# Altium schematic sheet LaunchpadHeader.SchDoc
size A4; SheetNumber: 2; SheetTotal: 4
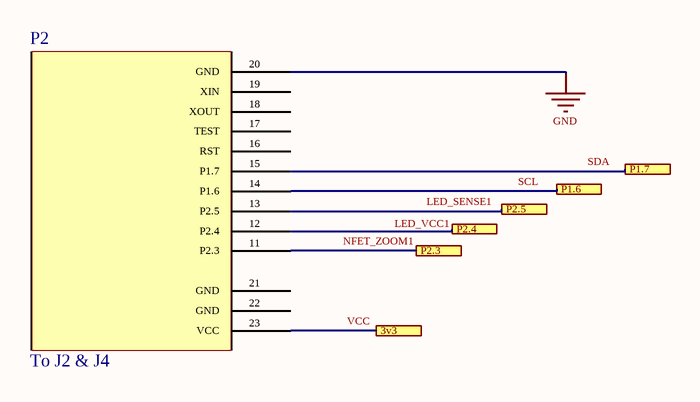
[diagram p0: LaunchpadHeader.SchDoc]

## Parts
P2  To J2 & J4  [MSP-EXP430G2 Mating Headers for J2/J4]

## Ports
3v3, P1.6, P1.7, P2.3, P2.4, P2.5

## Nets
GND: P2.20(GND)
3v3: P2.23(VCC) ; port 3v3
P1.6: P2.14(P1.6) ; port P1.6
P1.7: P2.15(P1.7) ; port P1.7
P2.3: P2.11(P2.3) ; port P2.3
P2.4: P2.12(P2.4) ; port P2.4
P2.5: P2.13(P2.5) ; port P2.5

Not connected (* = marked no-connect by the designer): P2 16(RST) 17(TEST) 18(XOUT) 19(XIN) 21(GND) 22(GND)

## Notes on the sheet
- LED_VCC1
- LED_SENSE1
- SCL
- SDA
- NFET_ZOOM1
- VCC

## Library data of the parts
P2 = MSP-EXP430G2 Mating Headers for J2/J4: Female Mating Headers for MSP-EXP430G2 J2 & J4 / (can use Würth Elektronik 61301011121 and 61300311121); Manufacturer: URC; Manufacturer Part Number: N/A; Value: N/A